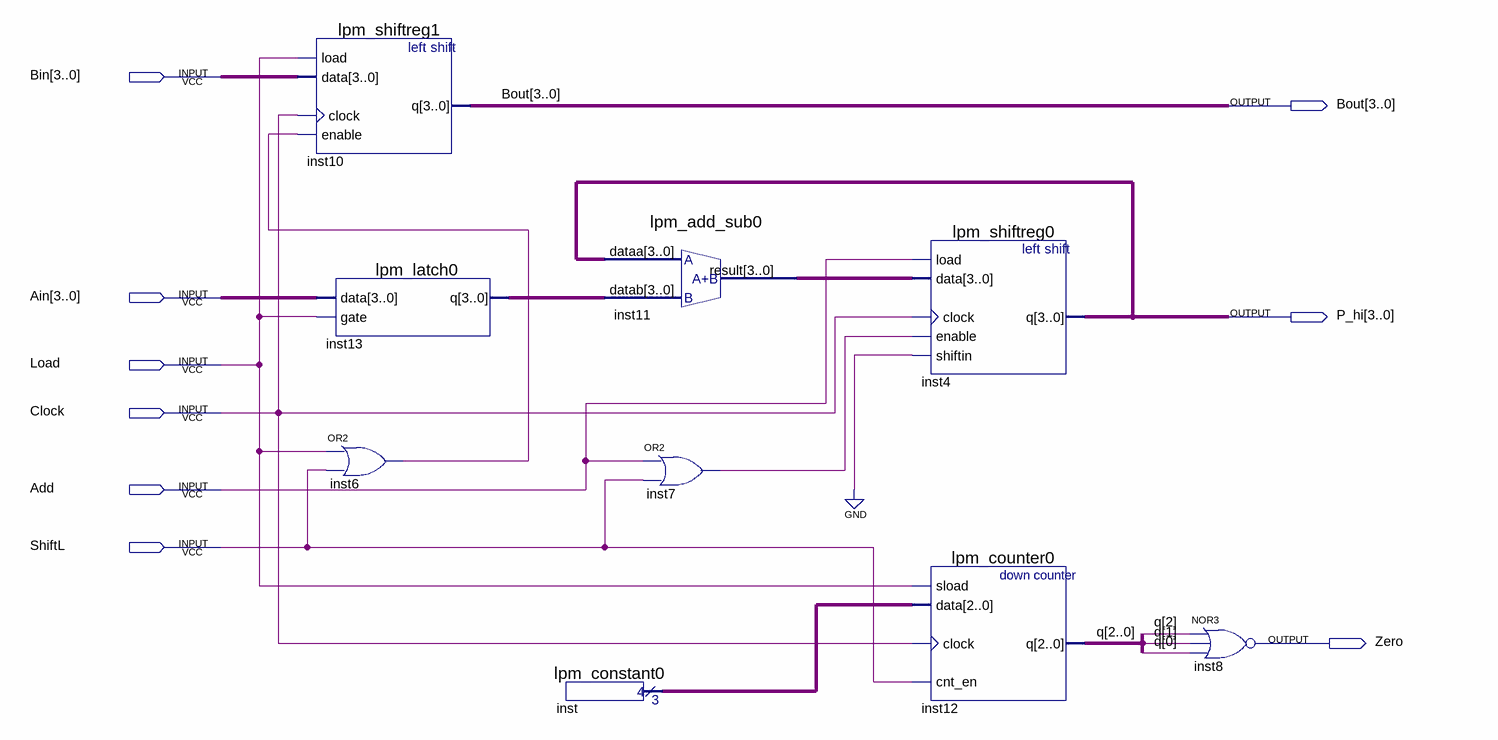
[diagram p0: schematic sheet]
// Quartus schematic OA.bdf as structural Verilog: 9 symbols, 9 pins
module OA (
  input  [3:0] Bin,
  input  [3:0] Ain,
  input  Load,
  input  Clock,
  input  Add,
  input  ShiftL,
  output [3:0] Bout,
  output [3:0] P_hi,
  output Zero
);

  wire inst6_out, inst7_out;
  wire [2:0] inst_result, q;
  wire [3:0] inst11_result, inst13_q;

  lpm_shiftreg1 inst10 (.load(Load), .data(Bin), .clock(Clock), .enable(inst6_out), .q(Bout));
  lpm_latch0 inst13 (.data(Ain), .gate(Load), .q(inst13_q));
  or inst6 (inst6_out, Load, ShiftL);
  lpm_add_sub0 inst11 (.dataa(P_hi), .datab(inst13_q), .result(inst11_result));
  lpm_constant0 inst (.result(inst_result));
  or inst7 (inst7_out, Add, ShiftL);
  lpm_shiftreg0 inst4 (.load(Add), .data(inst11_result), .clock(Clock), .enable(inst7_out), .shiftin(1'b0), .q(P_hi));
  lpm_counter0 inst12 (.sload(Load), .data(inst_result), .clock(Clock), .cnt_en(ShiftL), .q(q));
  nor inst8 (Zero, q[2], q[1], q[0]);
endmodule
